# EAGLE design front_DPS (EAGLE 7.0.0)
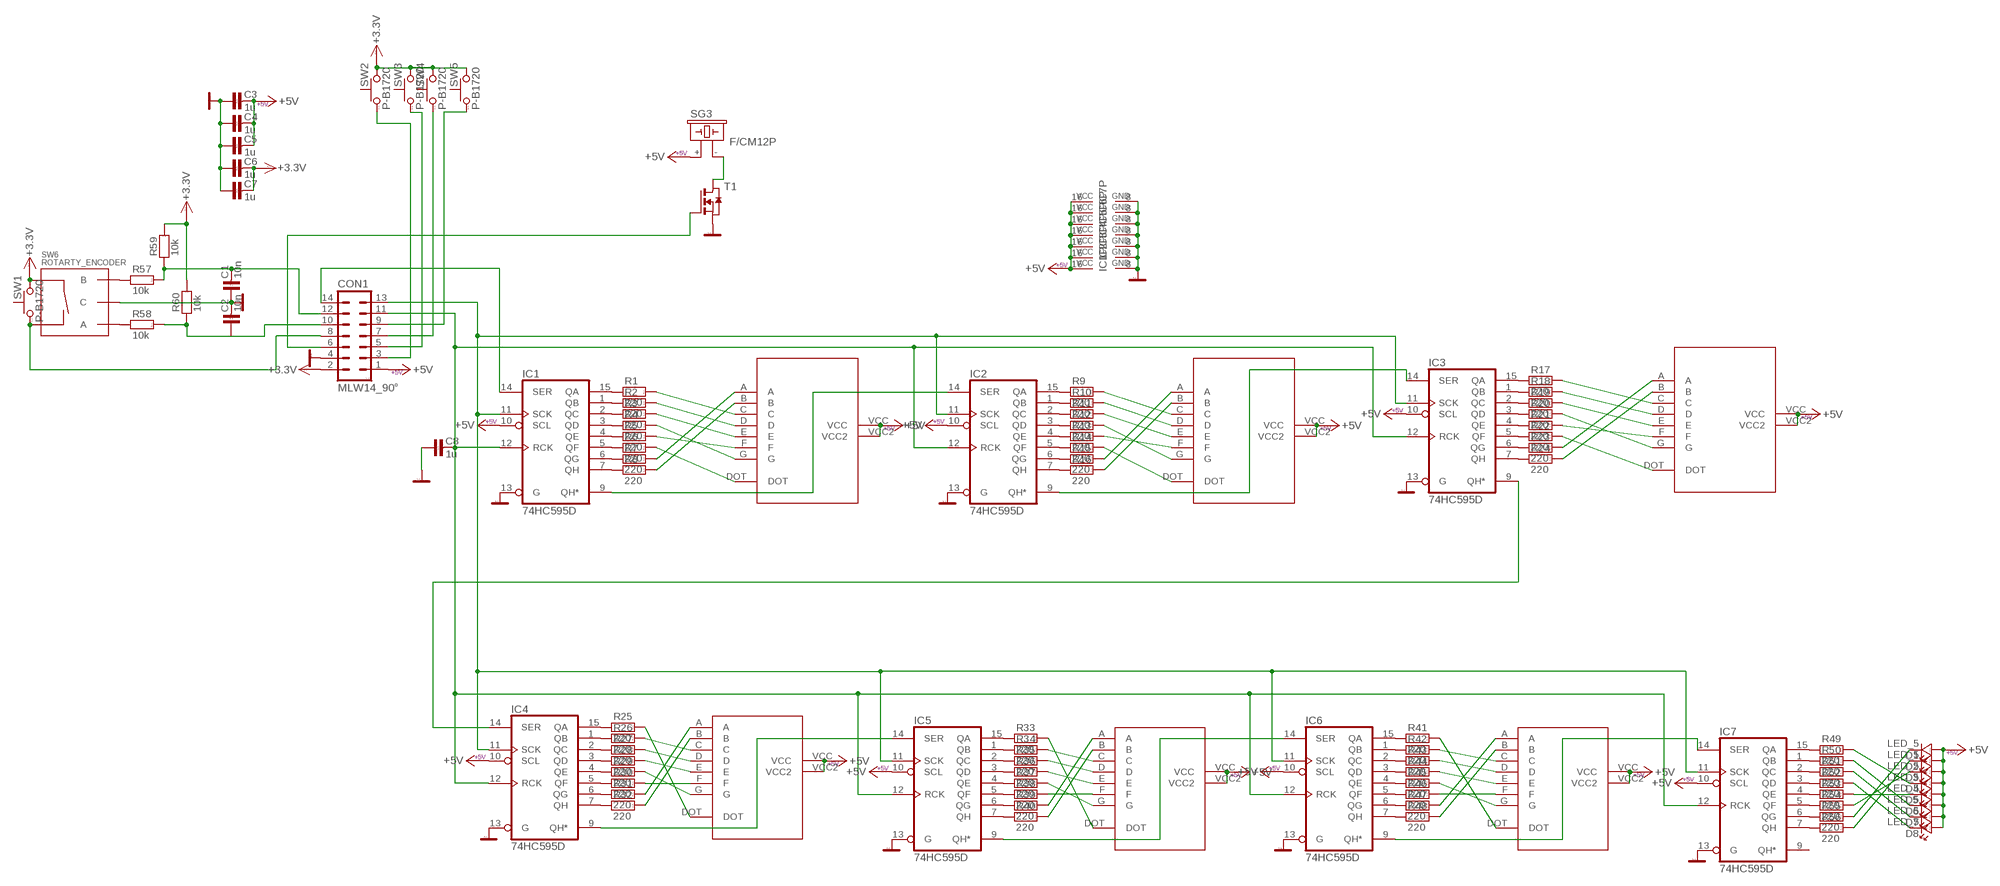
[diagram p0: schematic, sheet 1]

## Parts
C1  10n  C-KERAMIK_SMD_1206  [1206]
C2  10n  C-KERAMIK_SMD_1206  [1206]
C3  1u  C-KERAMIK_SMD_1206  [1206]
C4  1u  C-KERAMIK_SMD_1206  [1206]
C5  1u  C-KERAMIK_SMD_1206  [1206]
C6  1u  C-KERAMIK_SMD_1206  [1206]
C7  1u  C-KERAMIK_SMD_1206  [1206]
C8  1u  C-KERAMIK_SMD_1206  [1206]
CON1  MLW14_90°  [MLW14A]
D1  LED_5  [LED_5]
D2  LED_5  [LED_5]
D3  LED_5  [LED_5]
D4  LED_5  [LED_5]
D5  LED_5  [LED_5]
D6  LED_5  [LED_5]
D7  LED_5  [LED_5]
D8  LED_5  [LED_5]
IC1  74HC595D  [SO16]
IC2  74HC595D  [SO16]
IC3  74HC595D  [SO16]
IC4  74HC595D  [SO16]
IC5  74HC595D  [SO16]
IC6  74HC595D  [SO16]
IC7  74HC595D  [SO16]
R1  220  R_SMD_1206  [1206]
R2  220  R_SMD_1206  [1206]
R3  220  R_SMD_1206  [1206]
R4  220  R_SMD_1206  [1206]
R5  220  R_SMD_1206  [1206]
R6  220  R_SMD_1206  [1206]
R7  220  R_SMD_1206  [1206]
R8  220  R_SMD_1206  [1206]
R9  220  R_SMD_1206  [1206]
R10  220  R_SMD_1206  [1206]
R11  220  R_SMD_1206  [1206]
R12  220  R_SMD_1206  [1206]
R13  220  R_SMD_1206  [1206]
R14  220  R_SMD_1206  [1206]
R15  220  R_SMD_1206  [1206]
R16  220  R_SMD_1206  [1206]
R17  220  R_SMD_1206  [1206]
R18  220  R_SMD_1206  [1206]
R19  220  R_SMD_1206  [1206]
R20  220  R_SMD_1206  [1206]
R21  220  R_SMD_1206  [1206]
R22  220  R_SMD_1206  [1206]
R23  220  R_SMD_1206  [1206]
R24  220  R_SMD_1206  [1206]
R25  220  R_SMD_1206  [1206]
R26  220  R_SMD_1206  [1206]
R27  220  R_SMD_1206  [1206]
R28  220  R_SMD_1206  [1206]
R29  220  R_SMD_1206  [1206]
R30  220  R_SMD_1206  [1206]
R31  220  R_SMD_1206  [1206]
R32  220  R_SMD_1206  [1206]
R33  220  R_SMD_1206  [1206]
R34  220  R_SMD_1206  [1206]
R35  220  R_SMD_1206  [1206]
R36  220  R_SMD_1206  [1206]
R37  220  R_SMD_1206  [1206]
R38  220  R_SMD_1206  [1206]
R39  220  R_SMD_1206  [1206]
R40  220  R_SMD_1206  [1206]
R41  220  R_SMD_1206  [1206]
R42  220  R_SMD_1206  [1206]
R43  220  R_SMD_1206  [1206]
R44  220  R_SMD_1206  [1206]
R45  220  R_SMD_1206  [1206]
R46  220  R_SMD_1206  [1206]
R47  220  R_SMD_1206  [1206]
R48  220  R_SMD_1206  [1206]
R49  220  R_SMD_1206  [1206]
R50  220  R_SMD_1206  [1206]
R51  220  R_SMD_1206  [1206]
R52  220  R_SMD_1206  [1206]
R53  220  R_SMD_1206  [1206]
R54  220  R_SMD_1206  [1206]
R55  220  R_SMD_1206  [1206]
R56  220  R_SMD_1206  [1206]
R57  10k  R_SMD_1206  [1206]
R58  10k  R_SMD_1206  [1206]
R59  10k  R_SMD_1206  [1206]
R60  10k  R_SMD_1206  [1206]
SG3  F/CM12P  [F/CM12P]
SW1  P-B1720  [P-B1720]
SW2  P-B1720  [P-B1720]
SW3  P-B1720  [P-B1720]
SW4  P-B1720  [P-B1720]
SW5  P-B1720  [P-B1720]
SW6  ROTARTY_ENCODER  [ROTARY_ENC_PLAIN]
T1  NMOSSOT223  [SOT223]
U$1  7-SEGMENT-24X34-ANODE  [7-SEGMENT-24X34]
U$2  7-SEGMENT-24X34-ANODE  [7-SEGMENT-24X34]
U$3  7-SEGMENT-24X34-ANODE  [7-SEGMENT-24X34]
U$4  7-SEGMENT-44X30-ANODE  [7-SEGMENT-44X30]
U$5  7-SEGMENT-44X30-ANODE  [7-SEGMENT-44X30]
U$6  7-SEGMENT-44X30-ANODE  [7-SEGMENT-44X30]

## Nets
+5V: C3.2 C4.2 C5.2 CON1.1 D1.A D2.A D3.A D4.A D5.A D6.A D7.A D8.A IC1.10(SCL) IC1.16(VCC) IC2.10(SCL) IC2.16(VCC) IC3.10(SCL) IC3.16(VCC) IC4.10(SCL) IC4.16(VCC) IC5.10(SCL) IC5.16(VCC) IC6.10(SCL) IC6.16(VCC) IC7.10(SCL) IC7.16(VCC) SG3.+ U$1.VCC U$1.VCC2 U$2.VCC U$2.VCC2 U$3.VCC U$3.VCC2 U$4.VCC U$4.VCC2 U$5.VCC U$5.VCC2 U$6.VCC U$6.VCC2
GND: C1.1 C2.2 C3.1 C4.1 C5.1 C6.1 C7.1 C8.1 CON1.4 IC1.8(GND) IC1.13(G) IC2.8(GND) IC2.13(G) IC3.8(GND) IC3.13(G) IC4.8(GND) IC4.13(G) IC5.8(GND) IC5.13(G) IC6.8(GND) IC6.13(G) IC7.8(GND) IC7.13(G) SW6.C T1.3(S)
N$1: IC1.15(QA) R1.1
N$2: IC1.1(QB) R2.1
N$3: IC1.2(QC) R3.1
N$4: IC1.3(QD) R4.1
N$5: IC1.4(QE) R5.1
N$6: IC1.5(QF) R6.1
N$7: IC1.6(QG) R7.1
N$8: IC1.7(QH) R8.1
N$9: R1.2 U$4.C
N$10: R4.2 U$4.G
N$11: R5.2 U$4.F
N$12: R6.2 U$4.DOT
N$13: R7.2 U$4.A
N$14: R8.2 U$4.B
N$15: R2.2 U$4.D
N$16: IC2.15(QA) R9.1
N$17: IC2.1(QB) R10.1
N$18: IC2.2(QC) R11.1
N$19: IC2.3(QD) R12.1
N$20: IC2.4(QE) R13.1
N$21: IC2.5(QF) R14.1
N$22: IC3.7(QH) R24.1
N$23: R15.2 U$5.A
N$24: IC2.6(QG) R15.1
N$25: IC1.9(QH*) IC2.14(SER)
N$26: IC2.9(QH*) IC3.14(SER)
N$27: IC2.7(QH) R16.1
N$28: IC7.15(QA) R49.1
N$29: IC7.1(QB) R50.1
N$30: IC7.2(QC) R51.1
N$31: IC7.3(QD) R52.1
N$32: IC7.4(QE) R53.1
N$33: IC7.5(QF) R54.1
N$34: IC7.6(QG) R55.1
N$35: IC7.7(QH) R56.1
N$36: D6.K R50.2
N$37: D4.K R49.2
N$38: D7.K R51.2
N$39: D8.K R52.2
N$40: D5.K R53.2
N$41: D3.K R54.2
N$42: D1.K R55.2
N$43: D2.K R56.2
N$44: R16.2 U$5.B
N$45: R9.2 U$5.C
N$46: IC3.9(QH*) IC4.14(SER)
N$47: IC5.15(QA) R33.1
N$48: IC5.1(QB) R34.1
N$49: IC5.2(QC) R35.1
N$50: IC4.9(QH*) IC5.14(SER)
N$51: IC5.3(QD) R36.1
N$52: IC5.9(QH*) IC6.14(SER)
N$53: IC5.4(QE) R37.1
N$54: IC6.9(QH*) IC7.14(SER)
N$55: IC5.5(QF) R38.1
N$56: IC5.6(QG) R39.1
N$57: IC5.7(QH) R40.1
N$58: R39.2 U$2.A
N$59: R40.2 U$2.B
N$60: R33.2 U$2.DOT
N$61: R34.2 U$2.C
N$62: R35.2 U$2.D
N$63: CON1.13 IC1.11(SCK) IC2.11(SCK) IC3.11(SCK) IC4.11(SCK) IC5.11(SCK) IC6.11(SCK) IC7.11(SCK)
N$64: SG3.- T1.2(D) T1.4(D)
N$65: C1.2 CON1.12 R57.2 R59.1
N$66: C8.2 CON1.11 IC1.12(RCK) IC2.12(RCK) IC3.12(RCK) IC4.12(RCK) IC5.12(RCK) IC6.12(RCK) IC7.12(RCK)
N$67: R36.2 U$2.E
N$68: R38.2 U$2.F
N$69: IC4.15(QA) R25.1
N$70: IC4.1(QB) R26.1
N$71: IC4.2(QC) R27.1
N$72: IC4.3(QD) R28.1
N$73: IC4.4(QE) R29.1
N$74: IC4.5(QF) R30.1
N$75: IC4.6(QG) R31.1
N$76: IC4.7(QH) R32.1
N$77: R25.2 U$1.DOT
N$78: R26.2 U$1.C
N$79: R27.2 U$1.D
N$80: R28.2 U$1.E
N$81: R29.2 U$1.G
N$82: R30.2 U$1.F
N$83: R31.2 U$1.A
N$84: IC6.15(QA) R41.1
N$85: IC6.1(QB) R42.1
N$86: IC6.2(QC) R43.1
N$87: IC6.3(QD) R44.1
N$88: IC6.4(QE) R45.1
N$89: IC6.5(QF) R46.1
N$90: IC6.6(QG) R47.1
N$91: IC6.7(QH) R48.1
N$92: R41.2 U$3.DOT
N$93: R47.2 U$3.A
N$94: R48.2 U$3.B
N$95: R42.2 U$3.C
N$96: R43.2 U$3.D
N$97: R44.2 U$3.E
N$98: R46.2 U$3.F
N$99: R10.2 U$5.D
N$100: R11.2 U$5.E
N$101: R13.2 U$5.F
N$102: R12.2 U$5.G
N$103: R14.2 U$5.DOT
N$104: IC3.15(QA) R17.1
N$105: IC3.1(QB) R18.1
N$106: IC3.2(QC) R19.1
N$107: IC3.3(QD) R20.1
N$108: IC3.4(QE) R21.1
N$109: IC3.5(QF) R22.1
N$110: IC3.6(QG) R23.1
N$111: R23.2 U$6.A
N$112: R24.2 U$6.B
N$113: R17.2 U$6.C
N$114: R18.2 U$6.D
N$115: R19.2 U$6.E
N$116: R20.2 U$6.G
N$117: R21.2 U$6.F
N$118: R22.2 U$6.DOT
N$119: R3.2 U$4.E
N$120: R32.2 U$1.B
N$121: R37.2 U$2.G
N$122: R45.2 U$3.G
N$123: CON1.14 IC1.14(SER)
N$124: CON1.9 SW5.1
N$125: CON1.7 SW4.1
N$126: CON1.5 SW3.1
N$127: C2.1 CON1.10 R58.2 R60.1
N$128: CON1.6 T1.1(G)
N$129: R57.1 SW6.B
N$130: CON1.3 SW2.1
N$131: CON1.8 SW1.1 SW6.SW-
N$132: R58.1 SW6.A
VCC: C6.2 C7.2 CON1.2 R59.2 R60.2 SW1.2 SW2.2 SW3.2 SW4.2 SW5.2 SW6.SW+ ; supply symbol labelled +3.3V
Unconnected: IC7.9(QH*) SW1.3 SW1.4 SW2.3 SW2.4 SW3.3 SW3.4 SW4.3 SW4.4 SW5.3 SW5.4

## Library data of the parts
C1-C8 = #PaJa_30:C-KERAMIK: Kondenzator - keramicky
CON1 = #PaJa_konektory:MLW14: Konektory MLW - vidlice - 14x
D1-D8 = #PaJa_30:LED: LED - jednobarevna
IC1-IC7 = 74xx-eu:74*595: 8-bit SHIFT REGISTER, output latch
R1-R60 = #PaJa_30:R: Rezistor
SG3 = buzzer:F/CM12P: BUZZER Source: Buerklin; OC_FARNELL: unknown; OC_NEWARK: unknown
SW1-SW5 = #PaJa_prepinace:P-B1720: µ-tlacitko
SW6 = SparkFun-Electromechanical:ROTARTY_ENCODER: Simple no LED rotary encoder Example: COM-09117
T1 = zetex:NMOSSOT223: MOS FET; OC_FARNELL: unknown; OC_NEWARK: unknown
U$1-U$3 = kumen:7-SEGMENT-24X34-ANODE: 1inch 7segment Blue LED display common anode CPS 10016BBB 3V 5pcs <http://www.ebay.com/itm/360612062455?ssPageName=STRK:MEWAX:IT&_trksid=p3984.m1423.l2649>
U$4-U$6 = kumen:7-SEGMENT-44X30-ANODE: 10 pcs LED Display Common Anode 1.5" 44x30mm Red 10pin <http://www.ebay.com/itm/140767113609?ssPageName=STRK:MEWNX:IT&_trksid=p3984.m1439.l2649>

## Net classes
0 default: clearance 0.205 mm

## Board
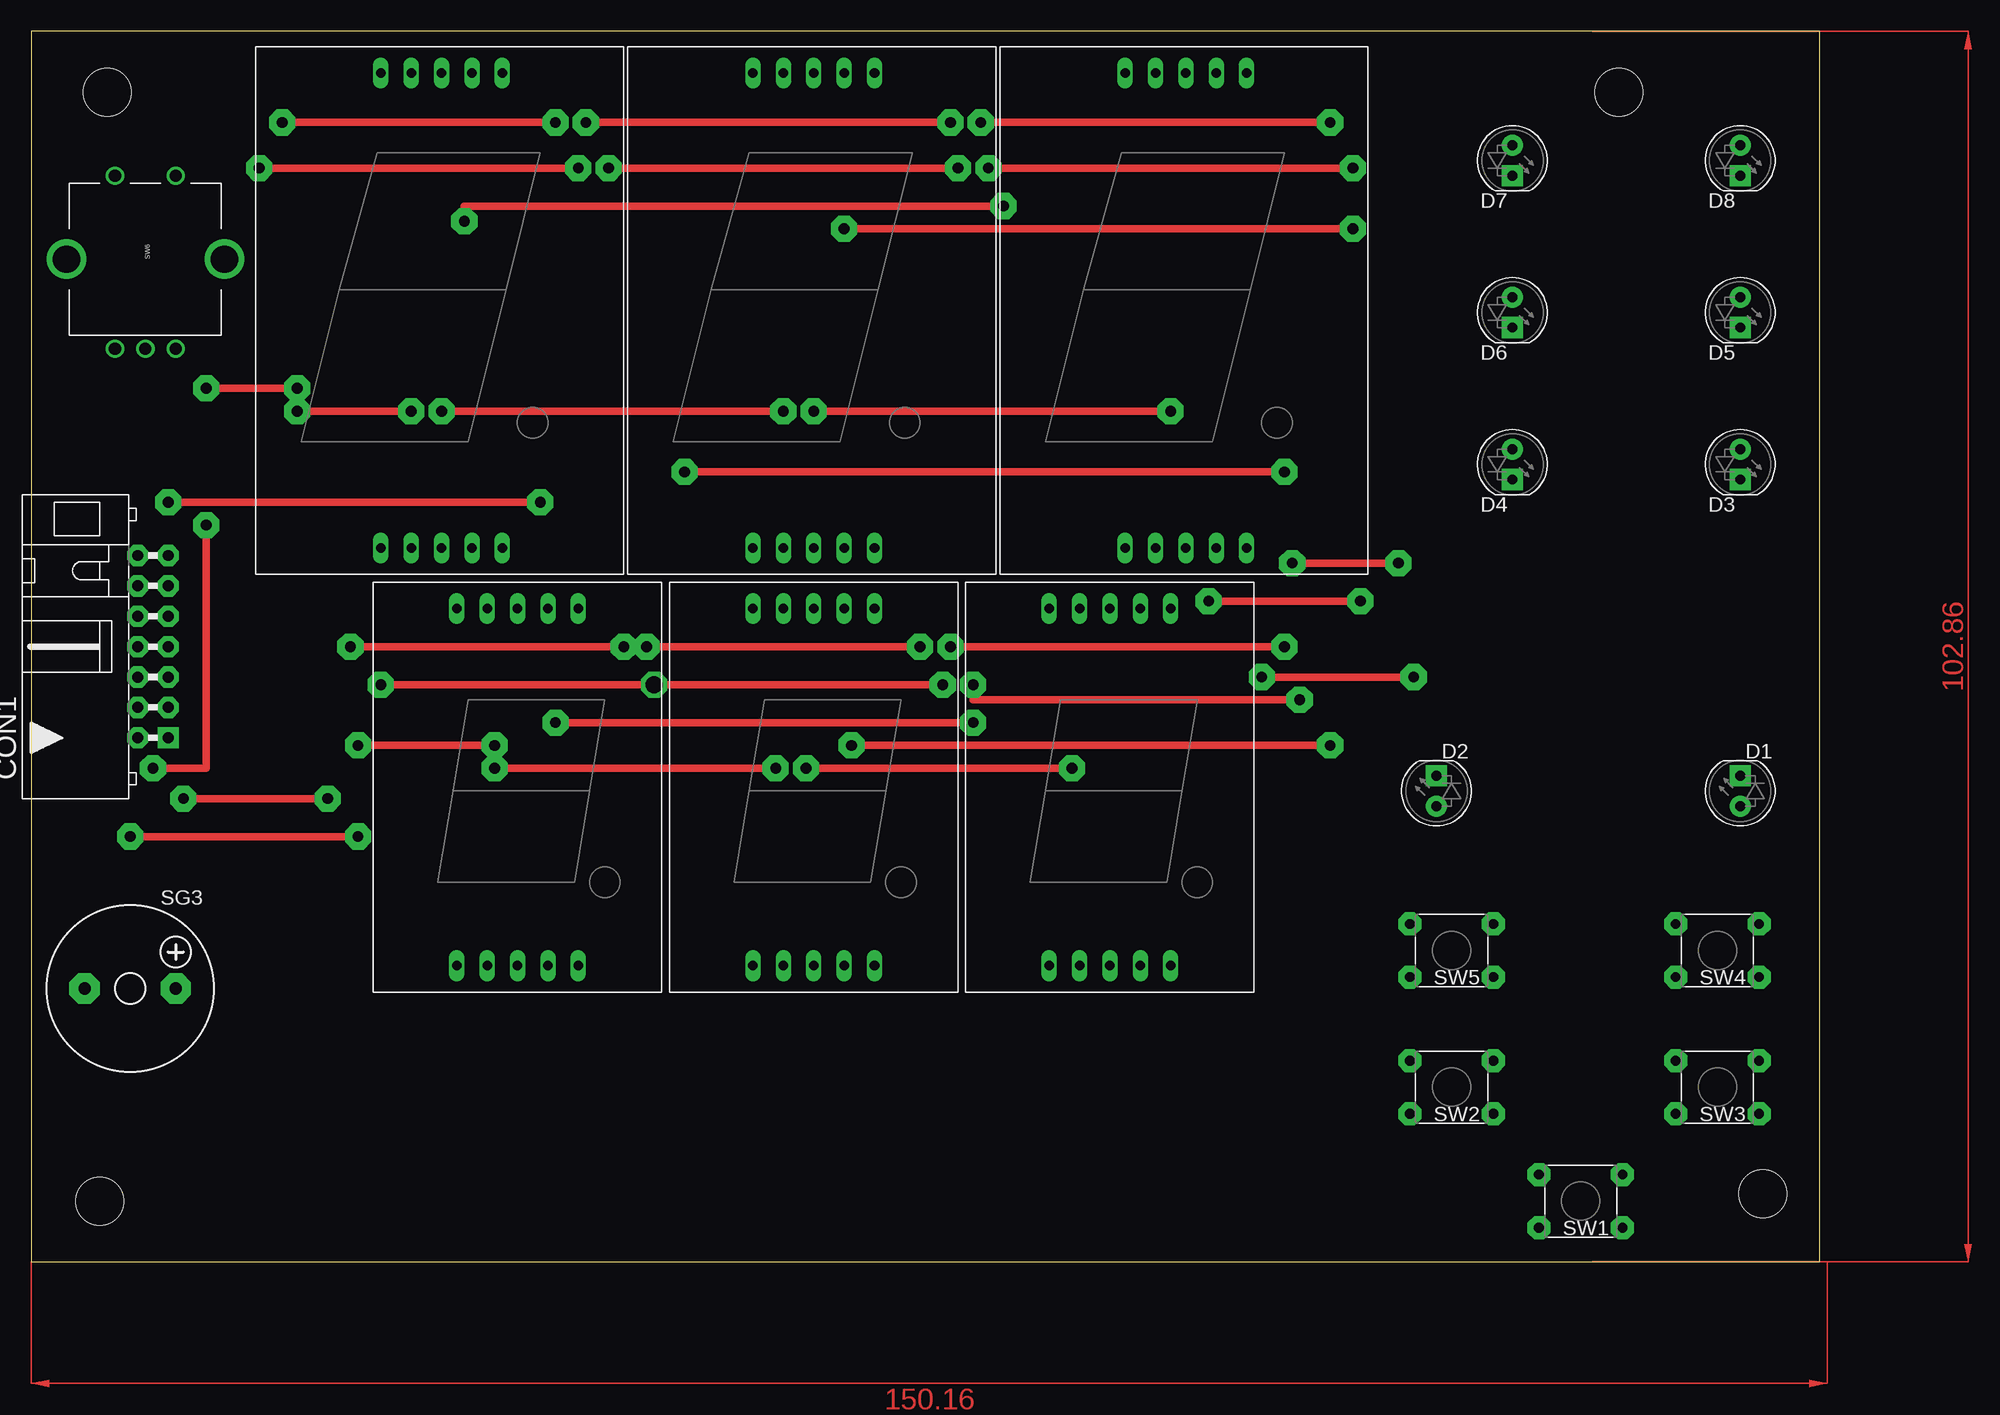
[diagram p1: board, top side]
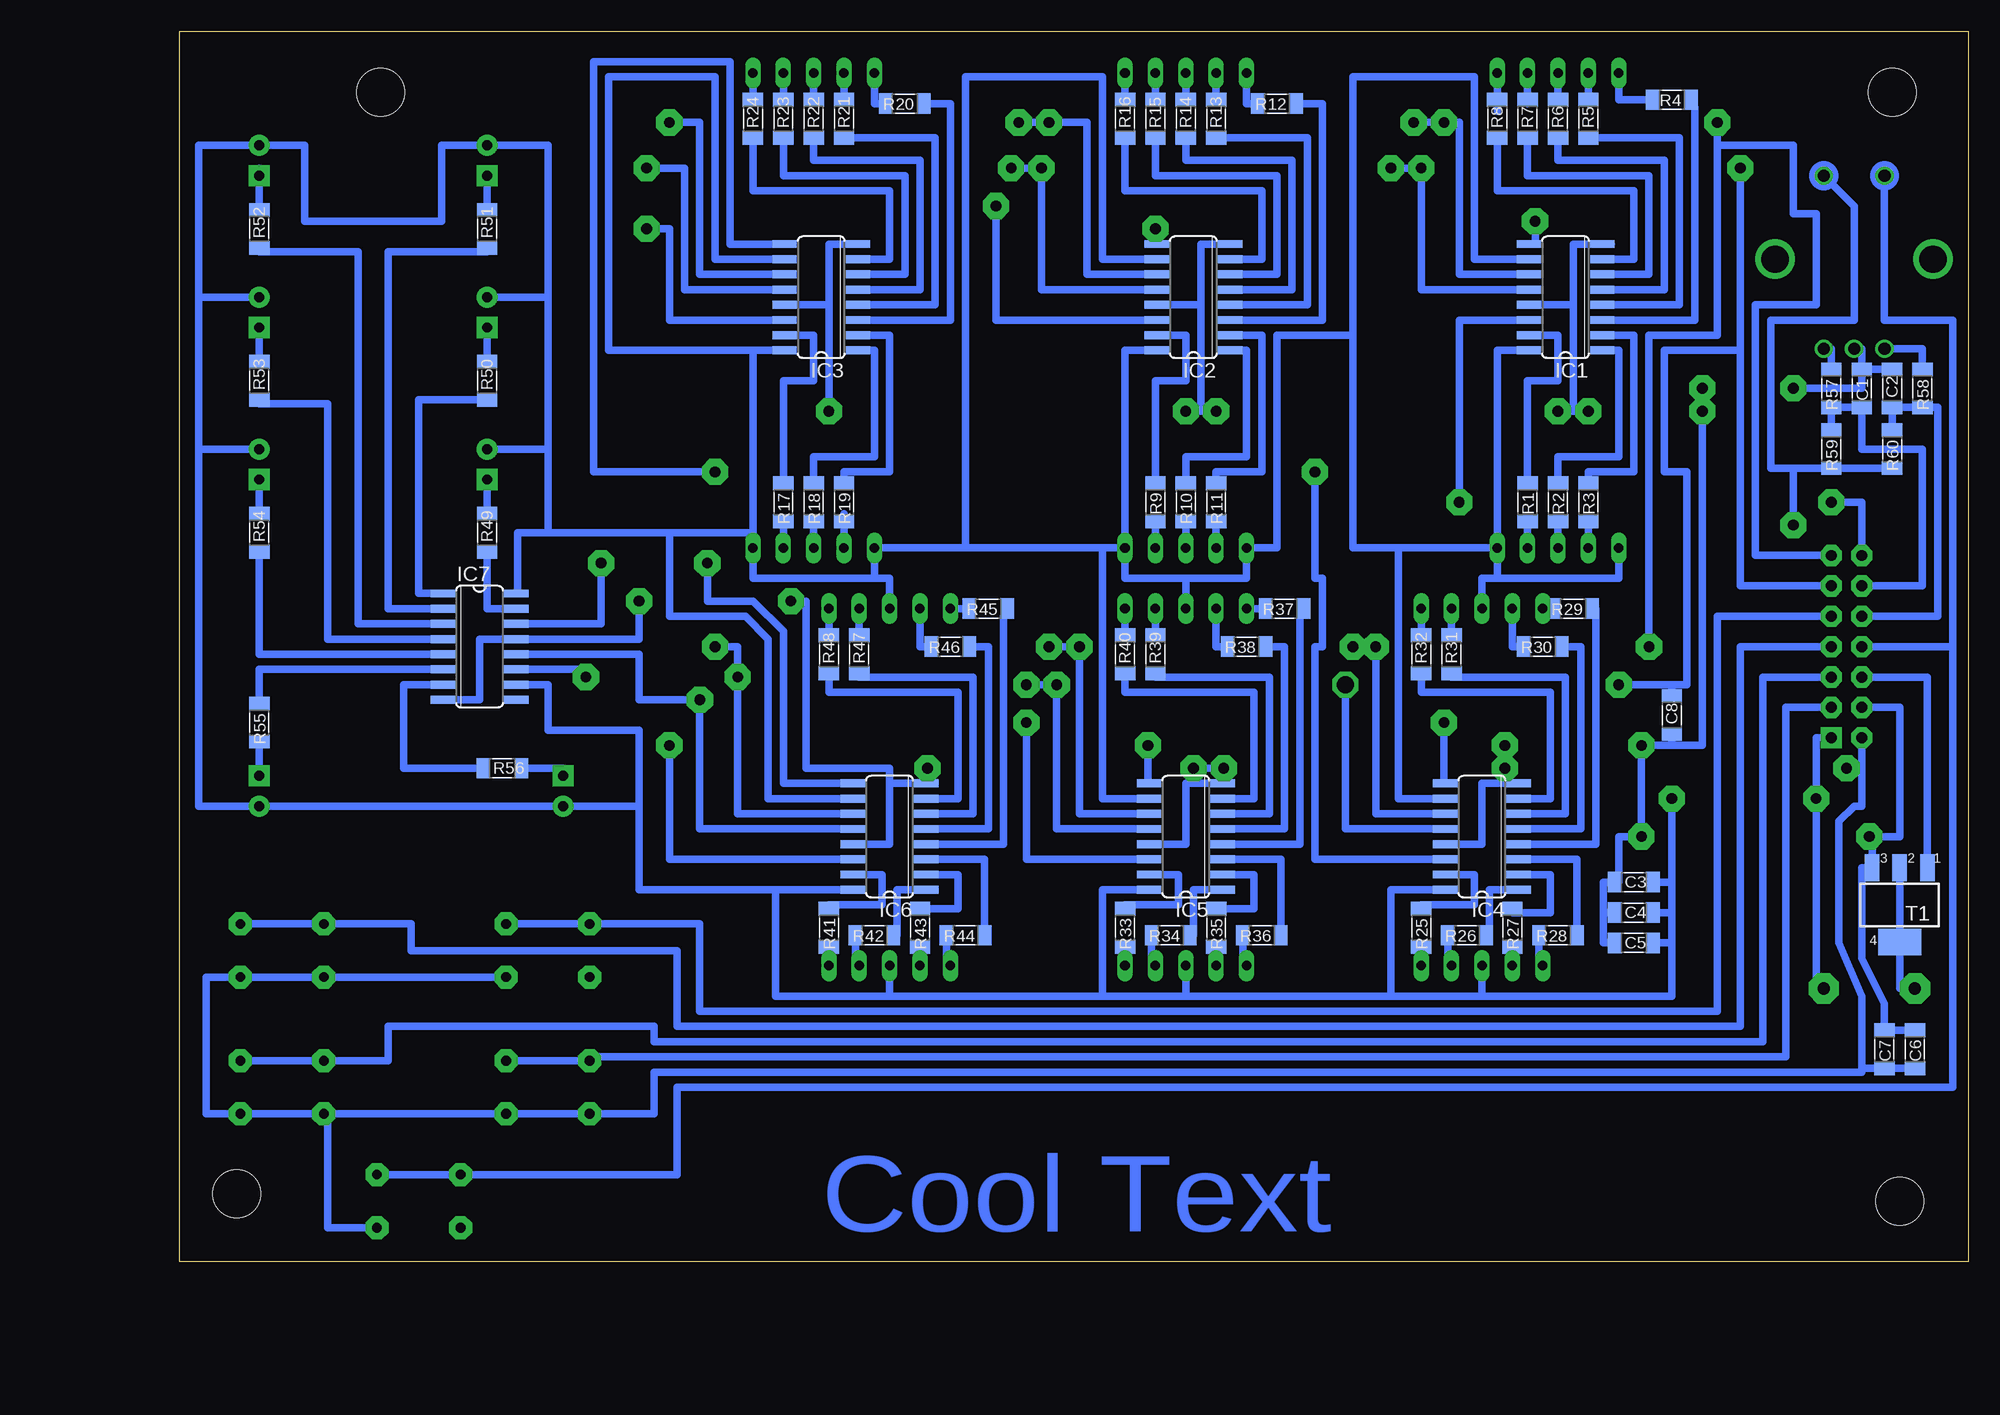
[diagram p2: board, bottom side, seen from below]

Size 149.53 x 102.87 mm. Coordinates in mm from the lower left corner, seen from the top.
Outline: 0,0 149.53,0 149.53,102.86 0,102.87 0,0
Copper layers (1*16): Top 0.035mm / dielectric 1.5mm / Bottom 0.035mm
Design rules "default *": minimum track width 10mil, minimum drill 24mil, track to track 8mil, track to pad 8mil, pad to pad 8mil, via to via 8mil, smd to smd 8mil, copper to edge 40mil, drill to drill 8mil, minimum pad ring 10mil, minimum via ring 8mil, stop-mask expansion 4mil, vias tented up to drill 0mil, thermal gap 10mil
Holes 4 mm at 132.72,97.79 6.35,97.79 5.71,5.08 144.78,5.71

### Footprints (pad centres in the part's own frame; a part is rotated, then mirrored left to right if it is on the bottom)
1206 = smd 1.143 x 1.702: 1 -1.587,0; 2 1.587,0
MLW14A = drill 0.914 pad 1.778 square: 1 -7.62,-1.27 | drill 0.914 pad 1.778 octagon: 2 -7.62,1.27; 3 -5.08,-1.27; 4 -5.08,1.27; 5 -2.54,-1.27; 6 -2.54,1.27; 7 0,-1.27; 8 0,1.27; 9 2.54,-1.27; 10 2.54,1.27; 11 5.08,-1.27; 12 5.08,1.27; 13 7.62,-1.27; 14 7.62,1.27
LED_5 = drill 0.813 pad 1.778: A -1.27,0 | drill 0.813 pad 1.778 square: K 1.27,0
SO16 = smd 0.66 x 2.032: 1 -4.445,-3.073; 2 -3.175,-3.073; 3 -1.905,-3.073; 4 -0.635,-3.073; 5 0.635,-3.073; 6 1.905,-3.073; 7 3.175,-3.073; 8 4.445,-3.073; 9 4.445,3.073; 10 3.175,3.073; 11 1.905,3.073; 12 0.635,3.073; 13 -0.635,3.073; 14 -1.905,3.073; 15 -3.175,3.073; 16 -4.445,3.073
F/CM12P = drill 1.016 pad 2.54 octagon: + 3.81,0; - -3.81,0
P-B1720 = drill 0.813 pad 1.93 octagon: 1 -3.493,-2.223; 2 -3.493,2.223; 3 3.493,-2.223; 4 3.493,2.223
ROTARY_ENC_PLAIN = drill 1.016: A 7.493,-2.54; B 7.493,2.54; C 7.493,0; SW+ -6.985,2.54; SW- -6.985,-2.54 | drill 2.286: P$3 0,6.604; P$4 0,-6.604
SOT223 = smd 1.219 x 2.235: 1 -2.311,-3.099; 2 0,-3.099; 3 2.311,-3.099 | smd 3.6 x 2.2: 4 0,3.099
7-SEGMENT-24X34 = drill 0.8 long: A 7.625,29.845; B 10.165,29.845; C 7.625,0; D 2.545,0; DOT 10.165,0; E 0.005,0; F 2.545,29.845; G 0.005,29.845; VCC 5.075,0; VCC2 5.075,29.845
7-SEGMENT-44X30 = drill 0.8 long: A 7.625,39.688; B 10.165,39.688; C 7.625,0; D 5.075,0; DOT 5.075,39.688; E 2.545,0; F 2.545,39.688; G 0.005,39.688; VCC 0.005,0; VCC2 10.165,0

### Placement (x,y rotation side)
C1  8.89,73.03 270 bottom
C2  6.35,73.03 90 bottom
C3  27.94,31.75 0 bottom
C4  27.94,29.21 0 bottom
C5  27.94,26.67 0 bottom
C6  4.45,17.78 270 bottom
C7  6.99,17.78 270 bottom
C8  24.77,45.72 90 bottom
CON1  10.16,51.44 90 top
D1  142.88,39.37 90 top
D2  117.47,39.37 90 top
D3  142.88,66.67 270 top
D4  123.83,66.67 270 top
D5  142.88,79.38 270 top
D6  123.83,79.38 270 top
D7  123.83,92.08 270 top
D8  142.88,92.08 270 top
IC1  33.66,80.64 90 bottom
IC2  64.77,80.64 90 bottom
IC3  95.89,80.64 90 bottom
IC4  40.64,35.56 90 bottom
IC5  65.41,35.56 90 bottom
IC6  90.17,35.56 90 bottom
IC7  124.46,51.44 270 bottom
R1  36.83,63.5 270 bottom
R2  34.29,63.5 270 bottom
R3  31.75,63.5 270 bottom
R4  24.77,97.16 180 bottom
R5  31.75,95.57 90 bottom
R6  34.29,95.57 90 bottom
R7  36.83,95.57 90 bottom
R8  39.37,95.57 90 bottom
R9  67.94,63.5 270 bottom
R10  65.41,63.5 270 bottom
R11  62.87,63.5 270 bottom
R12  57.78,96.84 180 bottom
R13  62.87,95.57 90 bottom
R14  65.41,95.57 90 bottom
R15  67.94,95.57 90 bottom
R16  70.48,95.57 90 bottom
R17  99.06,63.5 270 bottom
R18  96.52,63.5 270 bottom
R19  93.98,63.5 270 bottom
R20  88.9,96.84 180 bottom
R21  93.98,95.57 90 bottom
R22  96.52,95.57 90 bottom
R23  99.06,95.57 90 bottom
R24  101.6,95.57 90 bottom
R25  45.72,27.94 270 bottom
R26  41.91,27.3 180 bottom
R27  38.1,27.94 270 bottom
R28  34.29,27.3 180 bottom
R29  33.02,54.61 180 bottom
R30  35.56,51.44 180 bottom
R31  43.18,50.8 90 bottom
R32  45.72,50.8 90 bottom
R33  70.48,27.94 270 bottom
R34  66.67,27.3 180 bottom
R35  62.87,27.94 270 bottom
R36  59.05,27.3 180 bottom
R37  57.15,54.61 180 bottom
R38  60.33,51.44 180 bottom
R39  67.94,50.8 90 bottom
R40  70.48,50.8 90 bottom
R41  95.25,27.94 270 bottom
R42  91.44,27.3 180 bottom
R43  87.63,27.94 270 bottom
R44  83.82,27.3 180 bottom
R45  81.92,54.61 180 bottom
R46  85.09,51.44 180 bottom
R47  92.71,50.8 90 bottom
R48  95.25,50.8 90 bottom
R49  123.83,60.96 90 bottom
R50  123.83,73.66 90 bottom
R51  123.83,86.36 90 bottom
R52  142.88,86.36 90 bottom
R53  142.88,73.66 90 bottom
R54  142.88,60.96 90 bottom
R55  142.88,45.09 270 bottom
R56  122.56,41.27 0 bottom
R57  11.43,73.03 270 bottom
R58  3.81,73.03 270 bottom
R59  11.43,67.94 270 bottom
R60  6.35,67.94 270 bottom
SG3  8.26,22.86 0 top
SW1  129.54,5.08 180 top
SW2  118.75,14.61 180 top
SW3  140.97,14.61 180 top
SW4  140.97,26.04 180 top
SW5  118.75,26.04 180 top
SW6  9.53,83.82 270 top
T1  5.71,29.84 180 bottom
U$1  35.56,24.77 0 top
U$2  60.33,24.77 0 top
U$3  85.09,24.77 0 top
U$4  29.21,59.69 0 top
U$5  60.33,59.69 0 top
U$6  91.44,59.69 0 top

### Tracks (layer width: path | path; a pad name or v marks a point on that pad's centre or on a via)
+5V  (via drill 0.9 pad 2.18)
  Top 0.61: v24.77,38.73 v12.7,38.73
  Bottom 0.61: IC2.16 70.49,76.2 U$5.VCC2 | IC3.16 101.61,76.2 | 101.61,76.2 101.61,60.96 | U$4.VCC2 47.62,59.69 | IC1.16 39.38,76.2 U$4.VCC2 | U$5.VCC2 72.39,59.69 | 72.39,59.69 83.82,59.69 | 83.82,59.69 U$6.VCC | IC2.10 72.39,83.82 72.39,99.06 83.82,99.06 83.82,59.69 | 65.4,57.15 60.33,57.15 U$5.VCC 57.78,59.69 57.78,77.47 51.44,77.47 | 65.4,57.15 U$2.VCC2 | 65.4,57.15 70.49,57.15 U$5.VCC2 | U$6.VCC | U$6.VCC 91.44,57.15 | 91.44,57.15 101.6,57.15 101.6,58.42 101.61,60.96 | U$3.VCC2 90.17,57.15 91.44,57.15 | U$4.VCC 29.21,57.15 39.37,57.15 | 39.37,57.15 39.38,57.15 | 39.38,57.15 U$4.VCC2 | U$4.VCC2 39.37,57.15 | 39.38,57.15 40.63,57.15 U$1.VCC2 | U$1.VCC 40.64,22.23 | 40.64,22.23 48.26,22.23 | 72.39,22.23 90.17,22.23 | 90.17,22.23 U$3.VCC | IC4.16 48.26,31.11 48.26,22.23 | IC5.16 72.39,31.11 72.39,22.23 | 90.17,22.23 99.69,22.23 99.69,31.11 IC6.16 111.12,31.11 111.12,38.1 | IC5.10 72.39,38.73 72.39,59.69 | IC6.10 100.33,38.73 100.33,52.07 102.23,53.98 108.58,53.98 108.58,60.96 | 108.58,60.96 101.61,60.96 | IC3.10 104.78,83.82 104.78,99.06 113.67,99.06 113.67,76.2 101.61,76.2 | U$2.VCC 65.41,22.23 | 65.41,22.23 72.39,22.23 | 48.26,22.23 65.41,22.23 | IC4.10 47.62,38.73 47.62,59.69 | 118.75,60.96 121.28,60.96 121.28,55.88 IC7.16 | 118.75,60.96 108.58,60.96 | 147.96,80.64 147.96,93.34 D8.A 139.06,93.34 139.06,87 127.64,87 127.64,93.34 D7.A 118.75,93.34 118.75,80.64 | D5.A 147.96,80.64 | 147.96,80.64 147.96,67.94 | 147.96,67.94 D3.A | 47.62,59.69 51.44,59.69 51.44,77.47 | IC1.10 41.27,83.82 41.27,99.06 51.44,99.06 51.44,77.47 | D6.A 118.75,80.64 | 147.96,67.94 147.96,38.1 D1.A D2.A 111.12,38.1 | IC7.10 118.75,48.26 118.75,44.45 111.12,44.45 111.12,38.1
  Bottom 0.61: 118.75,60.96 118.75,67.94 | 118.75,67.94 118.75,80.64 | D4.A 118.75,67.94 | U$6.VCC2 101.61,60.96 | 40.64,22.23 24.77,22.23 24.77,26.67 | 24.77,26.67 24.77,29.21 | 24.77,29.21 24.77,31.75 | 24.77,31.75 v24.77,38.73 | CON1.1 12.7,43.81 v12.7,38.73 12.7,22.86 SG3.+ | C3.2 24.77,31.75 | C4.2 24.77,29.21 | C5.2 24.77,26.67
GND  (via drill 0.9 pad 2.18)
  Top 0.61: v34.29,71.12 v62.87,71.12 | v65.41,71.12 v95.25,71.12 | v31.75,71.12 v22.23,71.12 | v87,41.27 v64.77,41.27 | v62.23,41.27 v38.73,41.27 | v111.12,55.24 v98.42,55.24 | v8.26,35.56 v27.3,35.56 | v22.23,73.03 v14.61,73.03 | v38.73,43.18 v27.3,43.18
  Bottom 0.61: 29.84,85.09 IC1.8 33.02,85.09 33.02,80.01 | 61.59,85.09 IC2.8 64.14,85.09 64.14,80.01 | 33.02,80.01 33.02,71.12 | v95.25,71.12 95.25,80.01 | 95.25,80.01 95.25,85.09 IC3.8 | IC6.13 90.17,34.92 90.17,40.01 | 90.17,40.01 IC6.8 87,40.01 v87,41.27 | IC5.13 65.41,34.92 65.41,40.01 IC5.8 62.23,40.01 v62.23,41.27 v64.77,41.27 | IC4.13 40.64,34.92 40.64,40.01 38.73,40.01 | 38.73,40.01 IC4.8 | IC1.13 33.02,80.01 | IC2.13 64.14,80.01 | IC3.13 95.25,80.01 | 24.77,43.18 v27.3,43.18 v27.3,35.56 29.21,35.56 29.21,31.75 C3.1 30.48,31.75 30.48,29.21 | IC7.8 124.46,46.99 124.46,52.07 IC7.13 111.12,52.07 v111.12,55.24 | v98.42,55.24 97.16,55.24 97.16,41.27 90.17,41.27 90.17,40.01 | CON1.4 5.71,46.35 5.71,35.56 v8.26,35.56 8.03,35.56 T1.3 8.89,32.94 8.89,25.4 6.99,21.59 C7.1 C6.1 | v22.23,73.03 v22.23,71.12 22.23,43.18 24.77,43.18 | v38.73,43.18 v38.73,41.27 38.73,40.01 | v31.75,71.12 33.02,71.12 | 33.02,71.12 v34.29,71.12 | 64.14,80.01 64.14,71.12 | v62.87,71.12 64.14,71.12 | 64.14,71.12 v65.41,71.12 | v14.61,73.03 8.89,73.03 C1.1 | C2.2 C1.1 | SW6.C 8.89,76.33 C1.1 | C5.1 30.48,26.67 30.48,29.21 | C4.1 30.48,29.21 | 24.77,43.18 C8.1
N$1
  Bottom 0.61: IC1.15 34.29,77.47 34.29,73.66 36.83,73.66 R1.1
N$2
  Bottom 0.61: IC1.1 29.21,76.2 29.21,67.31 34.29,67.31 R2.1
N$3
  Bottom 0.61: IC1.2 27.94,77.47 27.94,66.04 31.75,66.04 R3.1
N$4
  Bottom 0.61: IC1.3 22.86,78.74 22.86,96.52 R4.1
N$5
  Bottom 0.61: R5.1 24.13,93.98 24.13,80.01 IC1.4
N$6
  Bottom 0.61: R6.1 34.29,92.08 25.4,92.08 25.4,81.28 IC1.5
N$7
  Bottom 0.61: R7.1 36.83,90.81 26.67,90.81 26.67,82.55 IC1.6
N$8
  Bottom 0.61: R8.1 39.37,89.53 27.94,89.53 27.94,83.82 IC1.7
N$9
  Bottom 0.61: U$4.C R1.2
N$10
  Bottom 0.61: R4.2 29.21,97.16 U$4.G
N$11
  Bottom 0.61: R5.2 31.75,96.84 U$4.F
N$12
  Bottom 0.61: R6.2 34.28,96.84 U$4.DOT
N$13
  Bottom 0.61: R7.2 36.84,96.84 U$4.A
N$14
  Bottom 0.61: R8.2 39.38,96.2 U$4.B
N$15
  Bottom 0.61: U$4.D R2.2
N$16
  Bottom 0.61: IC2.15 65.41,77.47 65.41,73.66 67.94,73.66 R9.1
N$17
  Bottom 0.61: R10.1 65.41,67.31 60.33,67.31 60.33,76.2 IC2.1
N$18
  Bottom 0.61: IC2.2 59.05,77.47 59.05,66.04 62.87,66.04 R11.1
N$19
  Bottom 0.61: IC2.3 53.98,78.74 53.98,96.84 R12.1
N$20
  Bottom 0.61: IC2.4 55.24,80.01 55.24,93.98 R13.1
N$21
  Bottom 0.61: IC2.5 56.52,81.28 56.52,92.08 65.41,92.08 R14.1
N$22
  Bottom 0.61: IC3.7 90.17,83.82 90.17,89.53 101.6,89.53 R24.1
N$23
  Bottom 0.61: U$5.A R15.2
N$24
  Bottom 0.61: IC2.6 57.78,82.55 57.78,90.81 67.94,90.81 R15.1
N$25  (via drill 0.9 pad 2.18)
  Top 0.61: v36.2,87 36.2,88.27 v81.28,88.27
  Bottom 0.61: IC1.9 36.2,85.09 v36.2,87 | v81.28,88.27 81.28,78.74 IC2.14
N$26  (via drill 0.9 pad 2.18)
  Top 0.61: v110.49,86.36 v67.94,86.36
  Bottom 0.61: IC2.9 v67.94,86.36 | IC3.14 108.58,78.74 108.58,86.36 v110.49,86.36
N$27
  Bottom 0.61: IC2.7 59.05,83.82 59.05,89.53 70.48,89.53 R16.1
N$28
  Bottom 0.61: IC7.15 123.83,54.61 R49.1
N$29
  Bottom 0.61: IC7.1 129.54,55.88 129.54,72.07 R50.1
N$30
  Bottom 0.61: IC7.2 132.08,54.61 132.08,84.45 123.83,84.45 R51.1
N$31
  Bottom 0.61: IC7.3 134.62,53.34 134.62,84.45 142.88,84.45 R52.1
N$32
  Bottom 0.61: IC7.4 137.16,52.07 137.16,71.75 142.88,71.75 R53.1
N$33
  Bottom 0.61: IC7.5 142.88,50.8 R54.1
N$34
  Bottom 0.61: IC7.6 142.88,49.53 R55.1
N$35
  Bottom 0.61: R56.1 130.81,41.27 130.81,48.26 IC7.7
N$36
  Bottom 0.61: R50.2 D6.K
N$37
  Bottom 0.61: R49.2 D4.K
N$38
  Bottom 0.61: D7.K R51.2
N$39
  Bottom 0.61: 142.88,91.44 D8.K R52.2
N$40
  Bottom 0.61: R53.2 D5.K
N$41
  Bottom 0.61: R54.2 D3.K
N$42
  Bottom 0.61: D1.K R55.2
N$43
  Bottom 0.61: R56.2 117.47,41.27 D2.K
N$44
  Bottom 0.61: U$5.B R16.2
N$45
  Bottom 0.61: R9.2 U$5.C
N$46  (via drill 0.9 pad 2.18)
  Top 0.61: v54.61,66.04 v104.78,66.04
  Bottom 0.61: IC4.14 54.61,33.66 54.61,51.44 53.98,51.44 53.98,57.15 54.61,57.15 v54.61,66.04 | IC3.9 103.5,85.09 103.5,100.33 114.94,100.33 114.94,66.04 v104.78,66.04
N$47
  Bottom 0.61: IC5.15 66.04,32.38 66.04,29.84 70.48,29.84 R33.1
N$48
  Bottom 0.61: IC5.1 64.77,31.11 64.77,27.3 R34.1
N$49
  Bottom 0.61: R35.1 59.69,29.53 59.69,32.38 IC5.2
N$50  (via drill 0.9 pad 2.18)
  Top 0.61: v78.74,45.09 v43.81,45.09
  Bottom 0.61: IC5.14 78.74,33.66 v78.74,45.09 | IC4.9 43.81,40.01 v43.81,45.09
N$51
  Bottom 0.61: R36.1 57.47,33.66 IC5.3
N$52  (via drill 0.9 pad 2.18)
  Top 0.61: v108.58,43.18 v68.58,43.18
  Bottom 0.61: IC5.9 68.58,40.01 v68.58,43.18 | IC6.14 108.58,33.66 v108.58,43.18
N$53
  Bottom 0.61: IC5.4 55.88,34.92 55.88,54.61 R37.1
N$54  (via drill 0.9 pad 2.18)
  Top 0.61: v105.41,58.42 v114.3,58.42
  Bottom 0.61: IC6.9 99.06,40.01 99.06,52.7 101.6,55.24 105.41,55.24 v105.41,58.42 | v114.3,58.42 114.3,53.34 IC7.14
N$55
  Bottom 0.61: IC5.5 57.15,36.2 57.15,51.44 R38.1
N$56
  Bottom 0.61: IC5.6 58.42,37.47 58.42,48.9 67.94,48.9 R39.1
N$57
  Bottom 0.61: IC5.7 59.69,38.73 59.69,47.62 70.48,47.62 R40.1
N$58
  Bottom 0.61: U$2.A R39.2
N$59
  Bottom 0.61: U$2.B R40.2
N$60
  Bottom 0.61: U$2.DOT R33.2
N$61
  Bottom 0.61: R34.2 68.26,24.77 U$2.C
N$62
  Bottom 0.61: R35.2 U$2.D
N$63  (via drill 0.9 pad 2.18)
  Top 0.61: v46.35,95.25 v76.83,95.25 | v108.58,95.25 v79.38,95.25 | v43.81,95.25 v20.95,95.25 | v115.57,48.9 v102.87,48.9 | v76.83,51.44 v104.78,51.44 | v26.67,51.44 v49.53,51.44 | v51.44,51.44 v74.3,51.44
  Bottom 0.61: IC2.11 73.66,82.55 73.66,95.25 v76.83,95.25 v79.38,95.25 | IC3.11 106.05,82.55 106.05,95.25 v108.58,95.25 | IC1.11 42.55,82.55 42.55,95.25 v43.81,95.25 v46.35,95.25 | IC4.11 49.53,37.47 v49.53,51.44 v51.44,51.44 | IC5.11 74.3,37.47 v74.3,51.44 v76.83,51.44 | IC6.11 102.87,37.47 v102.87,48.9 102.87,51.44 v104.78,51.44 | IC7.11 115.57,49.53 v115.57,48.9 | v26.67,51.44 26.67,77.47 20.95,77.47 v20.95,95.25 20.95,93.34 14.61,93.34 14.61,87.63 12.7,87.63 12.7,80.01 17.78,80.01 17.78,59.05 CON1.13
N$64
  Bottom 0.61: T1.2 T1.4 5.71,22.86 SG3.-
N$65
  Bottom 0.61: CON1.12 3.81,56.52 3.81,67.94 8.89,67.94 C1.2 R57.2 R59.1
N$66  (via drill 0.9 pad 2.18, 1.4 pad 2.18)
  Top 0.61: v48.26,91.44 v77.47,91.44 | v110.49,91.44 v80.01,91.44 | v45.72,91.44 v19.05,91.44 | v29.21,48.26 v52.07,48.26 v76.2,48.26 | v78.74,48.26 78.74,46.99 v106.05,46.99
  Bottom 0.61: IC2.12 77.47,81.28 v77.47,91.44 v80.01,91.44 | IC3.12 107.31,81.28 107.31,91.44 v110.49,91.44 | IC1.12 45.72,81.28 v45.72,91.44 v48.26,91.44 | IC5.12 76.2,36.2 v76.2,48.26 v78.74,48.26 | v52.07,48.26 52.07,36.2 IC4.12 | IC6.12 106.05,36.2 v106.05,46.99 111.12,46.99 111.12,50.8 IC7.12 | v29.21,48.26 24.77,48.26 | 19.05,76.2 v19.05,91.44 | 19.05,76.2 25.4,76.2 25.4,66.04 23.5,66.04 23.5,48.26 24.77,48.26 | 19.05,76.2 19.05,56.52 CON1.11 | 24.77,48.26 C8.2
N$67
  Bottom 0.61: R36.2 60.64,24.77 U$2.E
N$68
  Bottom 0.61: U$2.F 62.87,51.44 R38.2
N$69
  Bottom 0.61: R25.1 45.72,29.84 41.27,29.84 41.27,32.38 IC4.15
N$70
  Bottom 0.61: IC4.1 40.01,31.11 40.01,27.3 R26.1
N$71
  Bottom 0.61: R27.1 38.1,29.21 34.92,29.21 34.92,32.38 IC4.2
N$72
  Bottom 0.61: R28.1 32.7,33.66 IC4.3
N$73
  Bottom 0.61: IC4.4 31.11,34.92 31.11,54.61 R29.1
N$74
  Bottom 0.61: IC4.5 32.38,36.2 32.38,51.44 R30.1
N$75
  Bottom 0.61: IC4.6 33.66,37.47 33.66,48.9 43.18,48.9 R31.1
N$76
  Bottom 0.61: IC4.7 34.92,38.73 34.92,47.62 45.72,47.62 R32.1
N$77
  Bottom 0.61: U$1.DOT R25.2
N$78
  Bottom 0.61: U$1.C 43.5,24.77 R26.2
N$79
  Bottom 0.61: U$1.D R27.2
N$80
  Bottom 0.61: U$1.E 35.88,24.77 R28.2
N$81
  Bottom 0.61: U$1.G R29.2
N$82
  Bottom 0.61: U$1.F 38.1,51.44 R30.2
N$83
  Bottom 0.61: U$1.A 43.19,53.02 R31.2
N$84
  Bottom 0.61: R41.1 95.25,29.84 90.81,29.84 90.81,32.38 IC6.15
N$85
  Bottom 0.61: IC6.1 89.53,31.11 89.53,27.3 R42.1
N$86
  Bottom 0.61: IC6.2 84.45,32.38 84.45,29.53 R43.1
N$87
  Bottom 0.61: R44.1 82.23,33.66 IC6.3
N$88
  Bottom 0.61: R45.1 80.64,53.98 80.64,34.92 IC6.4
N$89
  Bottom 0.61: IC6.5 81.92,36.2 81.92,51.44 R46.1
N$90
  Bottom 0.61: IC6.6 83.19,37.47 83.19,48.9 92.71,48.9 R47.1
N$91
  Bottom 0.61: IC6.7 84.45,38.73 84.45,47.62 95.25,47.62 R48.1
N$92
  Bottom 0.61: U$3.DOT R41.2
N$93
  Bottom 0.61: U$3.A R47.2
N$94
  Bottom 0.61: U$3.B R48.2
N$95
  Bottom 0.61: R42.2 93.03,24.77 U$3.C
N$96
  Bottom 0.61: U$3.D R43.2
N$97
  Bottom 0.61: R44.2 85.41,24.77 U$3.E
N$98
  Bottom 0.61: U$3.F 87.64,51.44 R46.2
N$99
  Bottom 0.61: R10.2 U$5.D
N$100
  Bottom 0.61: U$5.E R11.2
N$101
  Bottom 0.61: R13.2 U$5.F
N$102
  Bottom 0.61: R12.2 60.33,96.84 U$5.G
N$103
  Bottom 0.61: U$5.DOT R14.2
N$104
  Bottom 0.61: IC3.15 96.52,77.47 96.52,73.66 99.06,73.66 R17.1
N$105
  Bottom 0.61: R18.1 96.52,67.31 91.44,67.31 91.44,76.2 IC3.1
N$106
  Bottom 0.61: IC3.2 90.17,77.47 90.17,66.04 93.98,66.04 R19.1
N$107
  Bottom 0.61: IC3.3 85.09,78.74 85.09,96.84 R20.1
N$108
  Bottom 0.61: IC3.4 86.36,80.01 86.36,93.98 R21.1
N$109
  Bottom 0.61: IC3.5 87.63,81.28 87.63,92.08 96.52,92.08 R22.1
N$110
  Bottom 0.61: IC3.6 88.9,82.55 88.9,90.81 99.06,90.81 R23.1
N$111
  Bottom 0.61: U$6.A R23.2
N$112
  Bottom 0.61: U$6.B R24.2
N$113
  Bottom 0.61: U$6.C R17.2
N$114
  Bottom 0.61: U$6.D R18.2
N$115
  Bottom 0.61: 93.98,62.55 R19.2 U$6.E
N$116
  Bottom 0.61: R20.2 91.44,96.84 U$6.G
N$117
  Bottom 0.61: U$6.F R21.2
N$118
  Bottom 0.61: U$6.DOT R22.2
N$119
  Bottom 0.61: U$4.E R3.2
N$120
  Bottom 0.61: U$1.B 45.73,53.02 R32.2
N$121
  Bottom 0.61: U$2.G R37.2
N$122
  Bottom 0.61: U$3.G R45.2
N$123  (via drill 0.9 pad 2.18)
  Top 0.61: v42.55,63.5 v11.43,63.5
  Bottom 0.61: IC1.14 42.55,78.74 v42.55,63.5 | CON1.14 8.89,63.5 v11.43,63.5
N$124
  Bottom 0.61: CON1.9 20.95,53.98 20.95,20.95 106.05,20.95 106.05,28.26 SW5.1
N$125
  Bottom 0.61: CON1.7 19.05,51.44 19.05,19.68 107.95,19.68 107.95,26.04 130.18,26.04 130.18,28.26 SW4.1
N$126
  Bottom 0.61: CON1.5 17.14,48.9 17.14,18.41 109.86,18.41 109.86,19.68 132.08,19.68 132.08,16.83 SW3.1
N$127
  Bottom 0.61: CON1.10 2.54,53.98 2.54,71.44 R58.2 C2.1 R60.1
N$128
  Bottom 0.61: CON1.6 3.4,48.9 T1.1
N$129
  Bottom 0.61: SW6.B 11.43,76.33 R57.1
N$130
  Bottom 0.61: CON1.3 15.24,46.35 15.24,17.14 115.57,17.14 115.57,16.83 SW2.1
N$131
  Bottom 0.61: SW6.SW- 6.99,78.74 1.27,78.74 1.27,51.44 | 1.27,51.44 1.27,14.61 107.95,14.61 107.95,7.3 SW1.1 | CON1.8 1.27,51.44
N$132
  Bottom 0.61: SW6.A 3.81,76.33 R58.1
VCC  (via drill 0.9 pad 2.18)
  Top 0.61: v14.61,61.59 14.61,41.27 v10.16,41.27
  Bottom 0.61: 8.89,16.19 8.89,22.23 10.79,26.67 10.79,36.83 9.53,38.1 8.89,38.1 8.89,41.27 | 8.89,16.19 8.89,15.88 109.86,15.88 109.86,12.38 SW2.2 SW3.2 | SW1.2 137.16,2.86 137.16,12.38 SW3.2 | v10.16,41.27 8.89,41.27 | 8.89,41.27 CON1.2 | SW3.2 147.32,12.38 147.32,23.81 SW4.2 SW5.2 | R60.2 R59.2 14.61,66.36 | 14.61,66.36 v14.61,61.59 | 14.61,66.36 16.51,66.36 16.51,78.74 9.53,78.74 9.53,88.27 SW6.SW+ | C6.2 C7.2 8.89,16.19
(copper drawn outside any net)
  shapes: Bottom circle x2, Top area x2

### Text on the board
Bottom: Cool Text